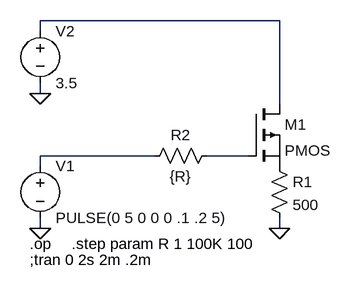
[diagram p0: schematic esc_circuit_v2.asc]
esc_circuit_v2.asc, the LTspice schematic file:
Version 4
SHEET 1 880 680
WIRE 208 -16 -160 -16
WIRE -160 0 -160 -16
WIRE -160 96 -160 80
WIRE 208 112 208 -16
WIRE 16 192 -160 192
WIRE 160 192 96 192
WIRE -160 208 -160 192
WIRE -160 304 -160 288
WIRE 208 304 208 288
FLAG -160 304 0
FLAG 208 304 0
FLAG -160 96 0
SYMBOL pmos 160 112 R0
SYMATTR InstName M1
SYMBOL voltage -160 192 R0
WINDOW 123 0 0 Left 2
WINDOW 39 0 0 Left 2
SYMATTR InstName V1
SYMATTR Value PULSE(0 5 0 0 0 .1 .2 5)
SYMBOL res 192 192 R0
SYMATTR InstName R1
SYMATTR Value 500
SYMBOL voltage -160 -16 R0
WINDOW 123 0 0 Left 2
WINDOW 39 0 0 Left 2
SYMATTR InstName V2
SYMATTR Value 3.5
SYMBOL res 112 176 R90
WINDOW 0 0 56 VBottom 2
WINDOW 3 32 56 VTop 2
SYMATTR InstName R2
SYMATTR Value {R}
TEXT -176 352 Left 2 !;tran 0 2s 2m .2m
TEXT -176 328 Left 2 !.op
TEXT -112 328 Left 2 !.step param R 1 100K 100

The netlist it stands for:
* esc_circuit_v2.asc
M1 N001 N003 P001 P001 PMOS
V1 N002 0 PULSE(0 5 0 0 0 .1 .2 5)
R1 P001 0 500
V2 N001 0 3.5
R2 N003 N002 {R}
.model NMOS NMOS
.model PMOS PMOS
.lib standard.mos
;tran 0 2s 2m .2m
.op
.step param R 1 100K 100
.backanno
.end

* Results of the author's LTspice run, read from the files saved beside the schematic
* From the log:
*   Semiconductor Device Operating Points:
*                           --- MOSFET Transistors ---
*   Name:          m1
*   Model:        pmos
*   Id:          5.62e-03
*   Vgs:        -2.80e+00
*   Vds:         7.00e-01
*   Vbs:         0.00e+00
*   Vth:        -0.00e+00
*   Vdsat:      -3.50e+00
*   Gm:          1.40e-05
*   Gds:         5.60e-05
*   Gmb:         0.00e+00
*   Cbd:         0.00e+00
*   Cbs:         0.00e+00
*   Cgsov:       0.00e+00
*   Cgdov:       0.00e+00
*   Cgbov:       0.00e+00
*   Cgs:         0.00e+00
*   Cgd:         0.00e+00
*   Cgb:         0.00e+00